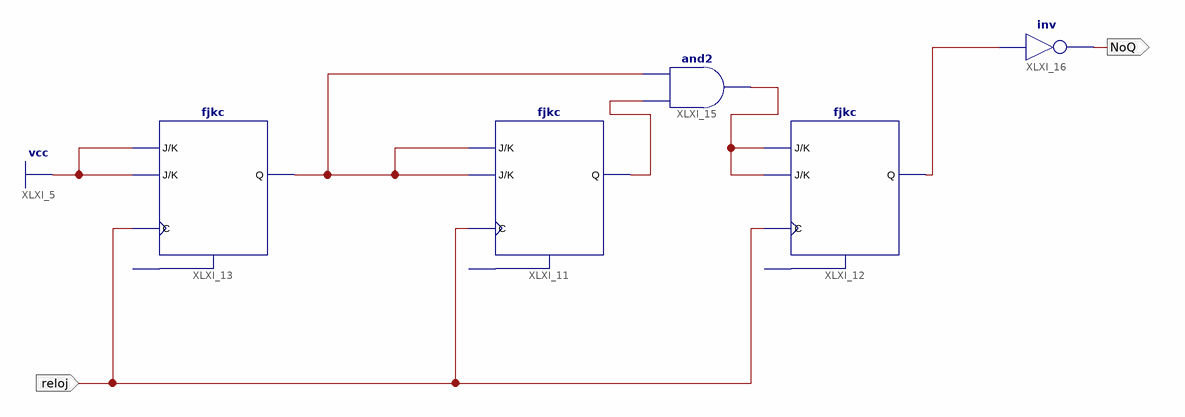
[diagram p0: schematic sheet 1]
// Xilinx ISE schematic Contador5S2.sch (spartan3e) as structural Verilog: 5 symbols, 2 ports
module Contador5S2 (
  input  reloj,
  output NoQ
);

  wire salidaQ, XLXN_21, XLXN_23, XLXN_25;

  fjkc XLXI_11 (.C(reloj), .J(XLXN_21), .K(XLXN_21), .Q(XLXN_25));  // open: CLR
  fjkc XLXI_12 (.C(reloj), .J(XLXN_23), .K(XLXN_23), .Q(salidaQ));  // open: CLR
  fjkc XLXI_13 (.C(reloj), .J(1'b1), .K(1'b1), .Q(XLXN_21));  // open: CLR
  and XLXI_15 (XLXN_23, XLXN_25, XLXN_21);
  not XLXI_16 (NoQ, salidaQ);
endmodule
